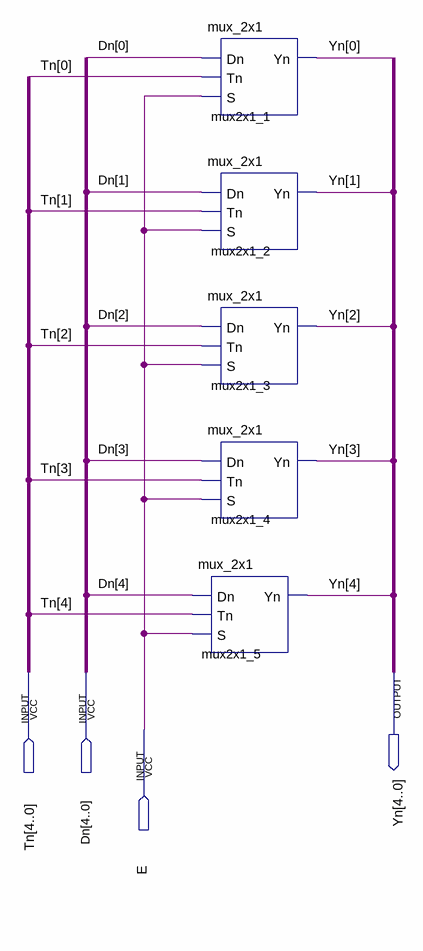
[diagram p0: schematic sheet]
// Quartus schematic complemento_2_seletor.bdf as structural Verilog: 5 symbols, 4 pins
module complemento_2_seletor (
  input  [4:0] Tn,
  input  [4:0] Dn,
  input  E,
  output [4:0] Yn
);

  mux_2x1 mux2x1_5 (.Dn(Dn[4]), .Tn(Tn[4]), .S(E), .Yn(Yn[4]));
  mux_2x1 mux2x1_1 (.Dn(Dn[0]), .Tn(Tn[0]), .S(E), .Yn(Yn[0]));
  mux_2x1 mux2x1_2 (.Dn(Dn[1]), .Tn(Tn[1]), .S(E), .Yn(Yn[1]));
  mux_2x1 mux2x1_3 (.Dn(Dn[2]), .Tn(Tn[2]), .S(E), .Yn(Yn[2]));
  mux_2x1 mux2x1_4 (.Dn(Dn[3]), .Tn(Tn[3]), .S(E), .Yn(Yn[3]));
endmodule
